# Altium schematic sheet High_Side_Switch.SchDoc
size A4; Organization: TESLA Motors, INC; Address1: 3500 Deer Creek Road; Address2: Palo Alto, CA; Address4: U.S.A.; SheetNumber: 7; SheetTotal: 8
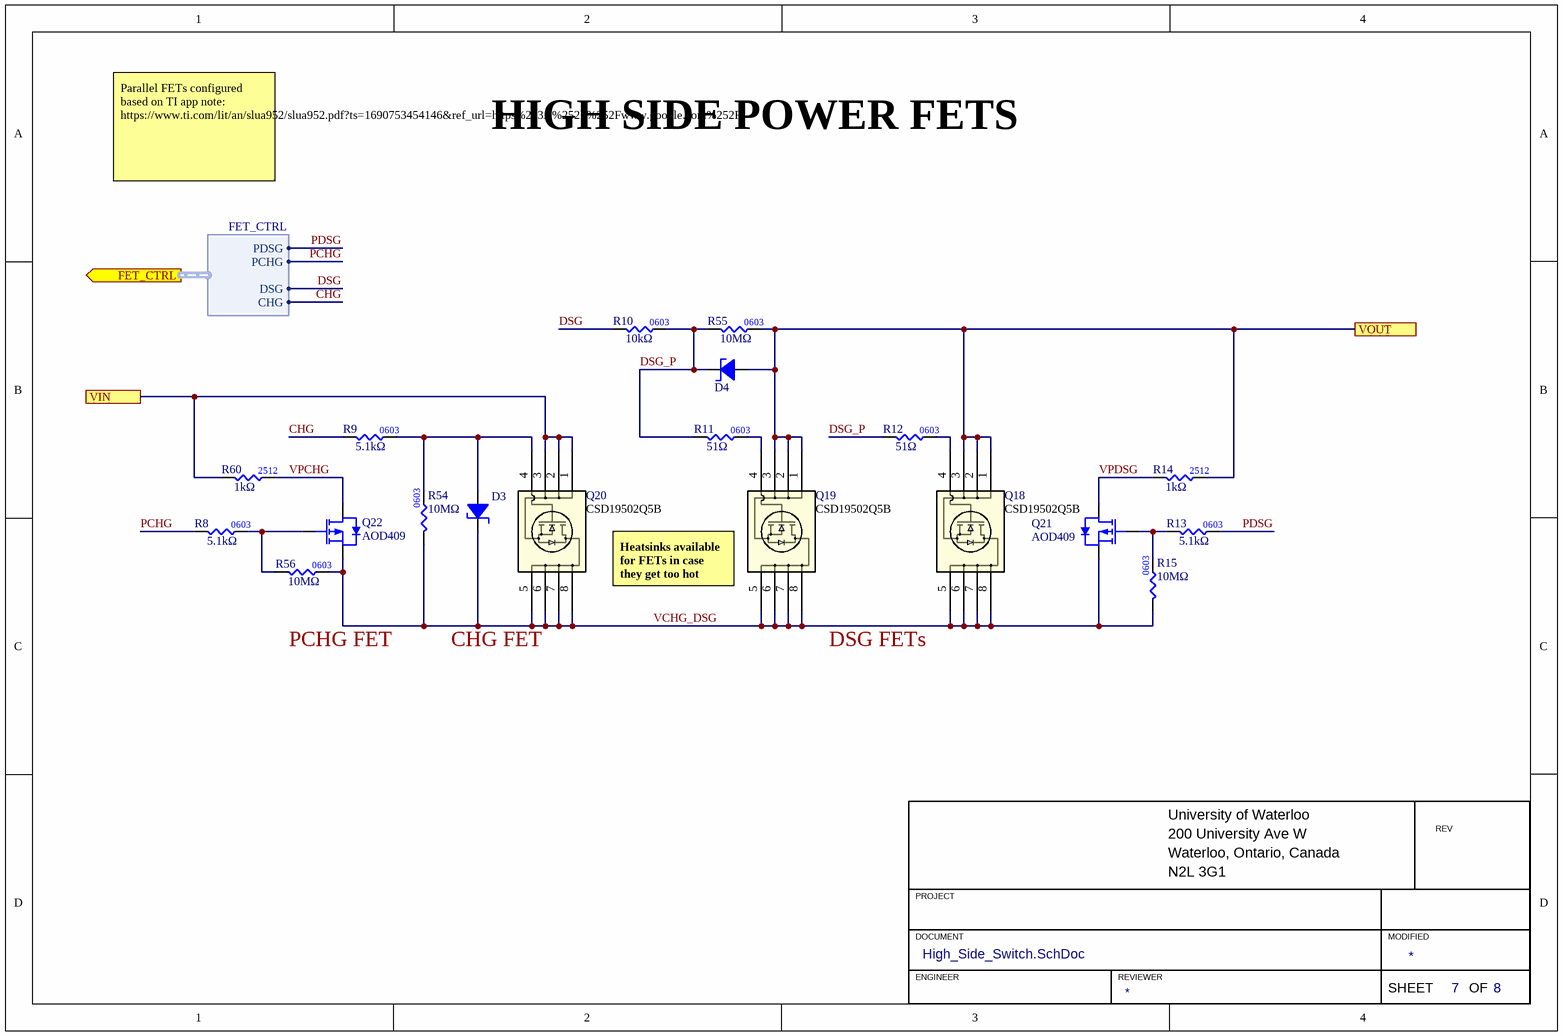
[diagram p0: High_Side_Switch.SchDoc]

## Parts
D3  DIO_ZENER_16V  [SOD-123_FLAT]  (value not drawn)
D4  DIO_ZENER_16V  [SOD-123_FLAT]  (value not drawn)
Q18  CSD19502Q5B  [DFN5060]
Q19  CSD19502Q5B  [DFN5060]
Q20  CSD19502Q5B  [DFN5060]
Q21  Manufacturer Part Number 1: AOD409  [TO-252 AOSMD]  (hidden comment: PMOS_60V_26A)
Q22  Manufacturer Part Number 1: AOD409  [TO-252 AOSMD]  (hidden comment: PMOS_60V_26A)
R8  value 5.1kΩ  [RES0603]  (hidden comment: RES_5.1kΩ_0603_1%)
R9  value 5.1kΩ  [RES0603]  (hidden comment: RES_5.1kΩ_0603_1%)
R10  value 10kΩ  [RES0603]  (hidden comment: RES_10kΩ_0603_1%)
R11  value 51Ω  [RES0603]  (hidden comment: RES_51Ω_0603_1%)
R12  value 51Ω  [RES0603]  (hidden comment: RES_51Ω_0603_1%)
R13  value 5.1kΩ  [RES0603]  (hidden comment: RES_5.1kΩ_0603_1%)
R14  value 1kΩ  [RES2512]  (hidden comment: RES_1kΩ_2512_1%)
R15  value 10MΩ  [RES0603]  (hidden comment: RES_10MΩ_0603_1%)
R54  value 10MΩ  [RES0603]  (hidden comment: RES_10MΩ_0603_1%)
R55  value 10MΩ  [RES0603]  (hidden comment: RES_10MΩ_0603_1%)
R56  value 10MΩ  [RES0603]  (hidden comment: RES_10MΩ_0603_1%)
R60  value 1kΩ  [RES2512]  (hidden comment: RES_1kΩ_2512_1%)

## Ports
FET_CTRL (out, harness FET_CTRL), VIN, VOUT

## Harnesses
FET_CTRL: PDSG, PCHG, DSG, CHG

## Nets
CHG: R9.1 ; port FET_CTRL.CHG
DSG: R10.1 ; port FET_CTRL.DSG
DSG_P: D4.2(Cathode) R10.2 R11.1 R12.1 R55.1
PCHG: R8.1 ; port FET_CTRL.PCHG
PDSG: R13.2 ; port FET_CTRL.PDSG
VCHG_DSG: D3.2(Cathode) Q18.5(D) Q18.6(D) Q18.7(D) Q18.8(D) Q19.5(D) Q19.6(D) Q19.7(D) Q19.8(D) Q20.5(D) Q20.6(D) Q20.7(D) Q20.8(D) Q21.3(Source) Q22.3(Source) R15.1 R54.1 R56.2
VIN: Q20.1(S) Q20.2(S) Q20.3(S) R60.1 ; port VIN
VOUT: D4.1(Anode) Q18.1(S) Q18.2(S) Q18.3(S) Q19.1(S) Q19.2(S) Q19.3(S) R14.2 R55.2 ; port VOUT
VPCHG: Q22.2(Drain) R60.2
VPDSG: Q21.2(Drain) R14.1
NetD3_1: D3.1(Anode) Q20.4(G) R9.2 R54.2
NetQ18_4: Q18.4(G) R12.2
NetQ19_4: Q19.4(G) R11.2
NetQ21_1: Q21.1(Gate) R13.1 R15.2
NetQ22_1: Q22.1(Gate) R8.2 R56.1

## Notes on the sheet
- Parallel FETs configured based on TI app note: https://www.ti.com/lit/an/slua952/slua952.pdf?ts=1690753454146&ref_url=https%253A%252F%252Fwww.google.com%252F
- HIGH SIDE POWER FETS
- Heatsinks available for FETs in case they get too hot
- PCHG FET
- CHG FET
- DSG FETs
- University of Waterloo
- 200 University Ave W
- REV
- PROJECT
- Waterloo, Ontario, Canada
- N2L 3G1
- DOCUMENT
- ENGINEER
- REVIEWER
- MODIFIED
- SHEET
- OF
- (in symbol RES_10MΩ_0603_1%) 0603
- (in symbol RES_51Ω_0603_1%) 0603

## Library data of the parts
D3 D4 = DIO_ZENER_16V: DIODE ZENER 16V 500MW SOD123; Manufacturer Part Number 1: DDZ9703-7; Manufacturer 1: Diodes Incorporated; Forward Voltage: 900mV; Supplier 1: Digi-Key; Supplier Part Number 1: DDZ9703-7DICT-ND
Q18-Q20 = NMOS_CSD19502Q5B_80V_100A: MOSFET N-CH 80V 100A 8VSON; Manufacturer 1: Texas Instruments; Vgs (Max): ±20V; Package/Footprint: 8-PowerTDFN; Vdss (Max): 80V; Id: 100A; Supplier 1: Digi-Key; Supplier Part Number 1: 296-37194-1-ND; Manufacturer Part Number 1: CSD19502Q5B
Q21 Q22 = PMOS_60V_26A: MOSFET P-CH 60V 26A TO252; Manufacturer 1: Alpha & Omega Semiconductor Inc.; Vgs (Max): ±20V; Vdss: 60V; Mounting Type: SMD; Id: 26A; Supplier 1: Digi-Key; Supplier Part Number 1: 785-1103-1-ND
R8 R9 R13 = RES_5.1kΩ_0603_1%: RES 5.1K OHM 1% 1/10W 0603; Manufacturer 1: YAGEO; Manufacturer Part Number 1: RC0603FR-135K1L; Mounting Type: SMD; Package: 0603; Supplier 1: Digi-Key; Supplier Part Number 1: 13-RC0603FR-135K1LCT-ND
R10 = RES_10kΩ_0603_1%: RES 10K OHM 1% 1/8W 0603; Manufacturer 1: Stackpole Electronics Inc; Manufacturer Part Number 1: RNCP0603FTD10K0; Supplier Part Number 1: RNCP0603FTD10K0CT-ND; Supplier 1: Digi-Key; Mounting Type: SMD; Package: 0603
R11 R12 = RES_51Ω_0603_1%: RES 51 OHM 1% 1/10W 0603; Manufacturer 1: YAGEO; Manufacturer Part Number 1: RC0603FR-0751RL; Supplier 1: Digi-Key; Supplier Part Number 1: 311-51.0HRCT-ND
R14 R60 = RES_1kΩ_2512_1%: RES SMD 1K OHM 1% 3W 2512; Manufacturer 1: TE Connectivity Passive Product; Manufacturer Part Number 1: 35221K0FT; Supplier Part Number 1: A121161CT-ND; Supplier 1: Digi-Key; Mounting Type: SMD; Package: 2512
R15 R54-R56 = RES_10MΩ_0603_1%: RES 10M OHM 1% 1/10W 0603; Manufacturer 1: YAGEO; Manufacturer Part Number 1: RC0603FR-0710ML; Supplier 1: Digi-Key; Supplier Part Number 1: 311-10.0MHRCT-ND